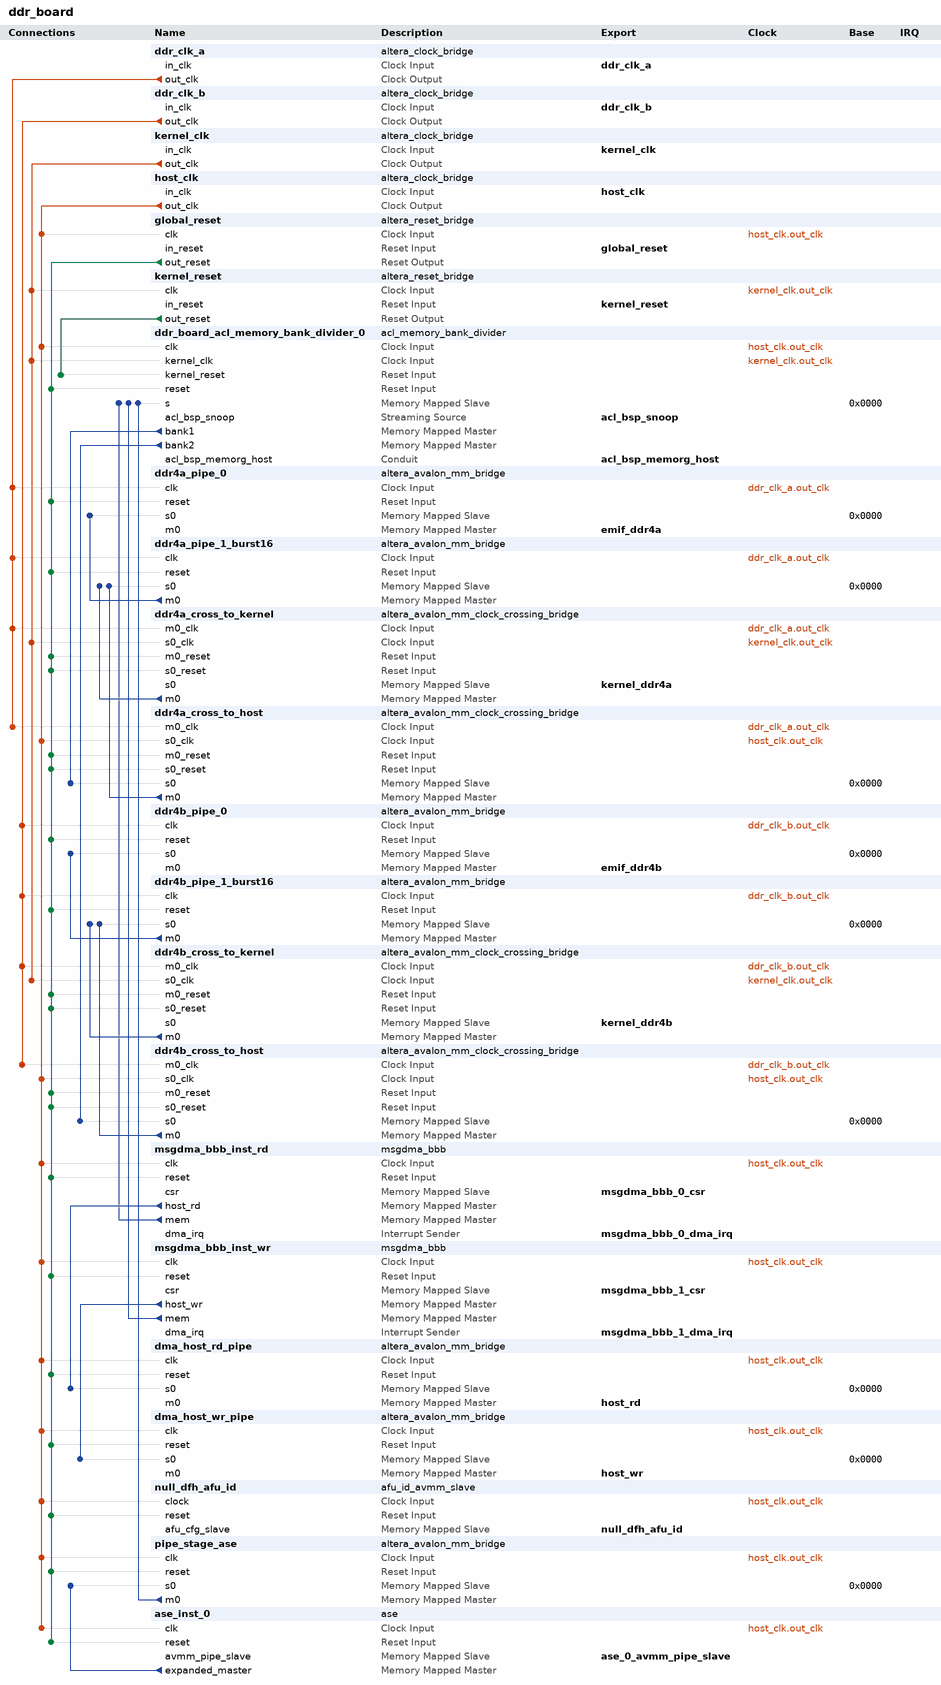
[diagram p0: system contents]
# Platform Designer (Qsys) system ddr_board, Arria 10 10AX115N2F40E2LG
# Parameters at their usual value, and those the tool derives, are not listed.
package require -exact qsys 1.0
create_system ddr_board
set_project_property DEVICE_FAMILY {Arria 10}
set_project_property DEVICE 10AX115N2F40E2LG

add_component ddr_clk_a ip/ddr_board/ddr_board_clock_bridge_0.ip altera_clock_bridge ddr_clk_a 19.1

add_component ddr_clk_b ip/ddr_board/ddr_board_clock_bridge_1.ip altera_clock_bridge ddr_clk_b 19.1
load_component ddr_clk_b
set_component_parameter_value DERIVED_CLOCK_RATE 266000000
set_component_parameter_value EXPLICIT_CLOCK_RATE 266000000
save_component

add_component kernel_clk ip/ddr_board/kernel_clk.ip altera_clock_bridge kernel_clk 19.1

add_component host_clk ip/ddr_board/ddr_clk.ip altera_clock_bridge host_clk 19.1

add_component global_reset ip/ddr_board/ddr_board_reset_bridge_0.ip altera_reset_bridge global_reset 19.1

add_component kernel_reset ip/ddr_board/ddr_board_reset_bridge_1.ip altera_reset_bridge kernel_reset 19.1
load_component kernel_reset
set_component_parameter_value ACTIVE_LOW_RESET 0
set_component_parameter_value SYNCHRONOUS_EDGES deassert
set_component_parameter_value SYNC_RESET 0
save_component

add_component ddr_board_acl_memory_bank_divider_0 ip/ddr_board/ddr_board_acl_memory_bank_divider_0.ip acl_memory_bank_divider ddr_board_acl_memory_bank_divider_0 1.0

add_component ddr4a_pipe_0 ip/ddr_board/ddr_board_mm_bridge_2.ip altera_avalon_mm_bridge ddr4a_pipe_0 19.1
load_component ddr4a_pipe_0
set_component_parameter_value DATA_WIDTH 512
set_component_parameter_value ADDRESS_WIDTH 32
set_component_parameter_value USE_AUTO_ADDRESS_WIDTH 0
set_component_parameter_value ADDRESS_UNITS SYMBOLS
set_component_parameter_value MAX_BURST_SIZE 64
set_component_parameter_value MAX_PENDING_RESPONSES 16
set_component_parameter_value SYNC_RESET 0
save_component

add_component ddr4a_pipe_1_burst16 ip/ddr_board/ddr_board_mm_bridge_3.ip altera_avalon_mm_bridge ddr4a_pipe_1_burst16 19.1
load_component ddr4a_pipe_1_burst16
set_component_parameter_value DATA_WIDTH 512
set_component_parameter_value ADDRESS_WIDTH 32
set_component_parameter_value USE_AUTO_ADDRESS_WIDTH 0
set_component_parameter_value ADDRESS_UNITS SYMBOLS
set_component_parameter_value MAX_BURST_SIZE 16
set_component_parameter_value MAX_PENDING_RESPONSES 16
set_component_parameter_value SYNC_RESET 0
save_component

add_component ddr4a_cross_to_kernel ip/ddr_board/ddr_board_mm_clock_crossing_bridge_0.ip altera_avalon_mm_clock_crossing_bridge ddr4a_cross_to_kernel 19.1
load_component ddr4a_cross_to_kernel
set_component_parameter_value DATA_WIDTH 512
set_component_parameter_value ADDRESS_WIDTH 32
set_component_parameter_value USE_AUTO_ADDRESS_WIDTH 0
set_component_parameter_value MAX_BURST_SIZE 16
set_component_parameter_value COMMAND_FIFO_DEPTH 64
set_component_parameter_value RESPONSE_FIFO_DEPTH 64
set_component_parameter_value MASTER_SYNC_DEPTH 2
set_component_parameter_value SLAVE_SYNC_DEPTH 2
set_component_parameter_value SYNC_RESET 0
save_component

add_component ddr4a_cross_to_host ip/ddr_board/ddr_board_mm_clock_crossing_bridge_1.ip altera_avalon_mm_clock_crossing_bridge ddr4a_cross_to_host 19.1
load_component ddr4a_cross_to_host
set_component_parameter_value DATA_WIDTH 512
set_component_parameter_value ADDRESS_WIDTH 32
set_component_parameter_value USE_AUTO_ADDRESS_WIDTH 0
set_component_parameter_value MAX_BURST_SIZE 16
set_component_parameter_value COMMAND_FIFO_DEPTH 64
set_component_parameter_value RESPONSE_FIFO_DEPTH 64
set_component_parameter_value MASTER_SYNC_DEPTH 2
set_component_parameter_value SLAVE_SYNC_DEPTH 2
set_component_parameter_value SYNC_RESET 0
save_component

add_component ddr4b_pipe_0 ip/ddr_board/ddr_board_mm_bridge_4.ip altera_avalon_mm_bridge ddr4b_pipe_0 19.1

add_component ddr4b_pipe_1_burst16 ip/ddr_board/ddr_board_mm_bridge_5.ip altera_avalon_mm_bridge ddr4b_pipe_1_burst16 19.1

add_component ddr4b_cross_to_kernel ip/ddr_board/ddr_board_mm_clock_crossing_bridge_2.ip altera_avalon_mm_clock_crossing_bridge ddr4b_cross_to_kernel 19.1

add_component ddr4b_cross_to_host ip/ddr_board/ddr_board_mm_clock_crossing_bridge_4.ip altera_avalon_mm_clock_crossing_bridge ddr4b_cross_to_host 19.1

add_component msgdma_bbb_inst_rd msgdma_bbb.qsys msgdma_bbb msgdma_bbb_inst_rd 

add_component msgdma_bbb_inst_wr msgdma_bbb.qsys msgdma_bbb msgdma_bbb_inst_wr 

add_component dma_host_rd_pipe ip/ddr_board/ddr_board_mm_bridge_6.ip altera_avalon_mm_bridge dma_host_rd_pipe 19.1

add_component dma_host_wr_pipe ip/ddr_board/ddr_board_mm_bridge_7.ip altera_avalon_mm_bridge dma_host_wr_pipe 19.1

add_component null_dfh_afu_id ip/ddr_board/ddr_board_afu_id_avmm_slave_0.ip afu_id_avmm_slave null_dfh_afu_id 1.0

add_component pipe_stage_ase ip/ddr_board/ddr4b_pipe_to_bankdiv_0.ip altera_avalon_mm_bridge pipe_stage_ase 19.1

add_component ase_inst_0 ase.qsys ase ase_inst_0 

# connections
add_connection ddr_clk_a.out_clk ddr4a_cross_to_host.m0_clk clock
add_connection ddr_clk_a.out_clk ddr4a_cross_to_kernel.m0_clk clock
add_connection ddr_clk_a.out_clk ddr4a_pipe_0.clk clock
add_connection ddr_clk_a.out_clk ddr4a_pipe_1_burst16.clk clock
add_connection ddr_clk_b.out_clk ddr4b_cross_to_host.m0_clk clock
add_connection ddr_clk_b.out_clk ddr4b_cross_to_kernel.m0_clk clock
add_connection ddr_clk_b.out_clk ddr4b_pipe_0.clk clock
add_connection ddr_clk_b.out_clk ddr4b_pipe_1_burst16.clk clock
add_connection host_clk.out_clk ase_inst_0.clk clock
add_connection host_clk.out_clk ddr4a_cross_to_host.s0_clk clock
add_connection host_clk.out_clk ddr4b_cross_to_host.s0_clk clock
add_connection host_clk.out_clk ddr_board_acl_memory_bank_divider_0.clk clock
add_connection host_clk.out_clk dma_host_rd_pipe.clk clock
add_connection host_clk.out_clk dma_host_wr_pipe.clk clock
add_connection host_clk.out_clk global_reset.clk clock
add_connection host_clk.out_clk msgdma_bbb_inst_rd.clk clock
add_connection host_clk.out_clk msgdma_bbb_inst_wr.clk clock
add_connection host_clk.out_clk null_dfh_afu_id.clock clock
add_connection host_clk.out_clk pipe_stage_ase.clk clock
add_connection kernel_clk.out_clk ddr4a_cross_to_kernel.s0_clk clock
add_connection kernel_clk.out_clk ddr4b_cross_to_kernel.s0_clk clock
add_connection kernel_clk.out_clk ddr_board_acl_memory_bank_divider_0.kernel_clk clock
add_connection kernel_clk.out_clk kernel_reset.clk clock
add_connection global_reset.out_reset ase_inst_0.reset reset
add_connection global_reset.out_reset ddr4a_cross_to_host.m0_reset reset
add_connection global_reset.out_reset ddr4a_cross_to_host.s0_reset reset
add_connection global_reset.out_reset ddr4a_cross_to_kernel.m0_reset reset
add_connection global_reset.out_reset ddr4a_cross_to_kernel.s0_reset reset
add_connection global_reset.out_reset ddr4a_pipe_0.reset reset
add_connection global_reset.out_reset ddr4a_pipe_1_burst16.reset reset
add_connection global_reset.out_reset ddr4b_cross_to_host.m0_reset reset
add_connection global_reset.out_reset ddr4b_cross_to_host.s0_reset reset
add_connection global_reset.out_reset ddr4b_cross_to_kernel.m0_reset reset
add_connection global_reset.out_reset ddr4b_cross_to_kernel.s0_reset reset
add_connection global_reset.out_reset ddr4b_pipe_0.reset reset
add_connection global_reset.out_reset ddr4b_pipe_1_burst16.reset reset
add_connection global_reset.out_reset ddr_board_acl_memory_bank_divider_0.reset reset
add_connection global_reset.out_reset dma_host_rd_pipe.reset reset
add_connection global_reset.out_reset dma_host_wr_pipe.reset reset
add_connection global_reset.out_reset msgdma_bbb_inst_rd.reset reset
add_connection global_reset.out_reset msgdma_bbb_inst_wr.reset reset
add_connection global_reset.out_reset null_dfh_afu_id.reset reset
add_connection global_reset.out_reset pipe_stage_ase.reset reset
add_connection kernel_reset.out_reset ddr_board_acl_memory_bank_divider_0.kernel_reset reset
add_connection ase_inst_0.expanded_master pipe_stage_ase.s0 avalon
set_connection_parameter_value ase_inst_0.expanded_master/pipe_stage_ase.s0 baseAddress 0x0000
add_connection ddr4a_cross_to_host.m0 ddr4a_pipe_1_burst16.s0 avalon
set_connection_parameter_value ddr4a_cross_to_host.m0/ddr4a_pipe_1_burst16.s0 baseAddress 0x0000
add_connection ddr4a_cross_to_kernel.m0 ddr4a_pipe_1_burst16.s0 avalon
set_connection_parameter_value ddr4a_cross_to_kernel.m0/ddr4a_pipe_1_burst16.s0 baseAddress 0x0000
add_connection ddr4a_pipe_1_burst16.m0 ddr4a_pipe_0.s0 avalon
set_connection_parameter_value ddr4a_pipe_1_burst16.m0/ddr4a_pipe_0.s0 baseAddress 0x0000
add_connection ddr4b_cross_to_host.m0 ddr4b_pipe_1_burst16.s0 avalon
set_connection_parameter_value ddr4b_cross_to_host.m0/ddr4b_pipe_1_burst16.s0 baseAddress 0x0000
add_connection ddr4b_cross_to_kernel.m0 ddr4b_pipe_1_burst16.s0 avalon
set_connection_parameter_value ddr4b_cross_to_kernel.m0/ddr4b_pipe_1_burst16.s0 baseAddress 0x0000
add_connection ddr4b_pipe_1_burst16.m0 ddr4b_pipe_0.s0 avalon
set_connection_parameter_value ddr4b_pipe_1_burst16.m0/ddr4b_pipe_0.s0 baseAddress 0x0000
add_connection ddr_board_acl_memory_bank_divider_0.bank1 ddr4a_cross_to_host.s0 avalon
set_connection_parameter_value ddr_board_acl_memory_bank_divider_0.bank1/ddr4a_cross_to_host.s0 baseAddress 0x0000
add_connection ddr_board_acl_memory_bank_divider_0.bank2 ddr4b_cross_to_host.s0 avalon
set_connection_parameter_value ddr_board_acl_memory_bank_divider_0.bank2/ddr4b_cross_to_host.s0 baseAddress 0x0000
add_connection msgdma_bbb_inst_rd.host_rd dma_host_rd_pipe.s0 avalon
set_connection_parameter_value msgdma_bbb_inst_rd.host_rd/dma_host_rd_pipe.s0 baseAddress 0x0000
add_connection msgdma_bbb_inst_rd.mem ddr_board_acl_memory_bank_divider_0.s avalon
set_connection_parameter_value msgdma_bbb_inst_rd.mem/ddr_board_acl_memory_bank_divider_0.s baseAddress 0x0000
add_connection msgdma_bbb_inst_wr.host_wr dma_host_wr_pipe.s0 avalon
set_connection_parameter_value msgdma_bbb_inst_wr.host_wr/dma_host_wr_pipe.s0 baseAddress 0x0000
add_connection msgdma_bbb_inst_wr.mem ddr_board_acl_memory_bank_divider_0.s avalon
set_connection_parameter_value msgdma_bbb_inst_wr.mem/ddr_board_acl_memory_bank_divider_0.s baseAddress 0x0000
add_connection pipe_stage_ase.m0 ddr_board_acl_memory_bank_divider_0.s avalon
set_connection_parameter_value pipe_stage_ase.m0/ddr_board_acl_memory_bank_divider_0.s baseAddress 0x0000

# exported interfaces
add_interface acl_bsp_memorg_host conduit end
set_interface_property acl_bsp_memorg_host EXPORT_OF ddr_board_acl_memory_bank_divider_0.acl_bsp_memorg_host
add_interface acl_bsp_snoop avalon_streaming source
set_interface_property acl_bsp_snoop EXPORT_OF ddr_board_acl_memory_bank_divider_0.acl_bsp_snoop
add_interface ase_0_avmm_pipe_slave avalon slave
set_interface_property ase_0_avmm_pipe_slave EXPORT_OF ase_inst_0.avmm_pipe_slave
add_interface ddr_clk_a clock sink
set_interface_property ddr_clk_a EXPORT_OF ddr_clk_a.in_clk
add_interface ddr_clk_b clock sink
set_interface_property ddr_clk_b EXPORT_OF ddr_clk_b.in_clk
add_interface emif_ddr4a avalon master
set_interface_property emif_ddr4a EXPORT_OF ddr4a_pipe_0.m0
add_interface emif_ddr4b avalon master
set_interface_property emif_ddr4b EXPORT_OF ddr4b_pipe_0.m0
add_interface global_reset reset sink
set_interface_property global_reset EXPORT_OF global_reset.in_reset
add_interface host_clk clock sink
set_interface_property host_clk EXPORT_OF host_clk.in_clk
add_interface host_rd avalon master
set_interface_property host_rd EXPORT_OF dma_host_rd_pipe.m0
add_interface host_wr avalon master
set_interface_property host_wr EXPORT_OF dma_host_wr_pipe.m0
add_interface kernel_clk clock sink
set_interface_property kernel_clk EXPORT_OF kernel_clk.in_clk
add_interface kernel_ddr4a avalon slave
set_interface_property kernel_ddr4a EXPORT_OF ddr4a_cross_to_kernel.s0
add_interface kernel_ddr4b avalon slave
set_interface_property kernel_ddr4b EXPORT_OF ddr4b_cross_to_kernel.s0
add_interface kernel_reset reset sink
set_interface_property kernel_reset EXPORT_OF kernel_reset.in_reset
add_interface msgdma_bbb_0_csr avalon slave
set_interface_property msgdma_bbb_0_csr EXPORT_OF msgdma_bbb_inst_rd.csr
add_interface msgdma_bbb_0_dma_irq interrupt sender
set_interface_property msgdma_bbb_0_dma_irq EXPORT_OF msgdma_bbb_inst_rd.dma_irq
add_interface msgdma_bbb_1_csr avalon slave
set_interface_property msgdma_bbb_1_csr EXPORT_OF msgdma_bbb_inst_wr.csr
add_interface msgdma_bbb_1_dma_irq interrupt sender
set_interface_property msgdma_bbb_1_dma_irq EXPORT_OF msgdma_bbb_inst_wr.dma_irq
add_interface null_dfh_afu_id avalon slave
set_interface_property null_dfh_afu_id EXPORT_OF null_dfh_afu_id.afu_cfg_slave

save_system ddr_board.qsys
